# EAGLE design Headset board (EAGLE 9.5.0)
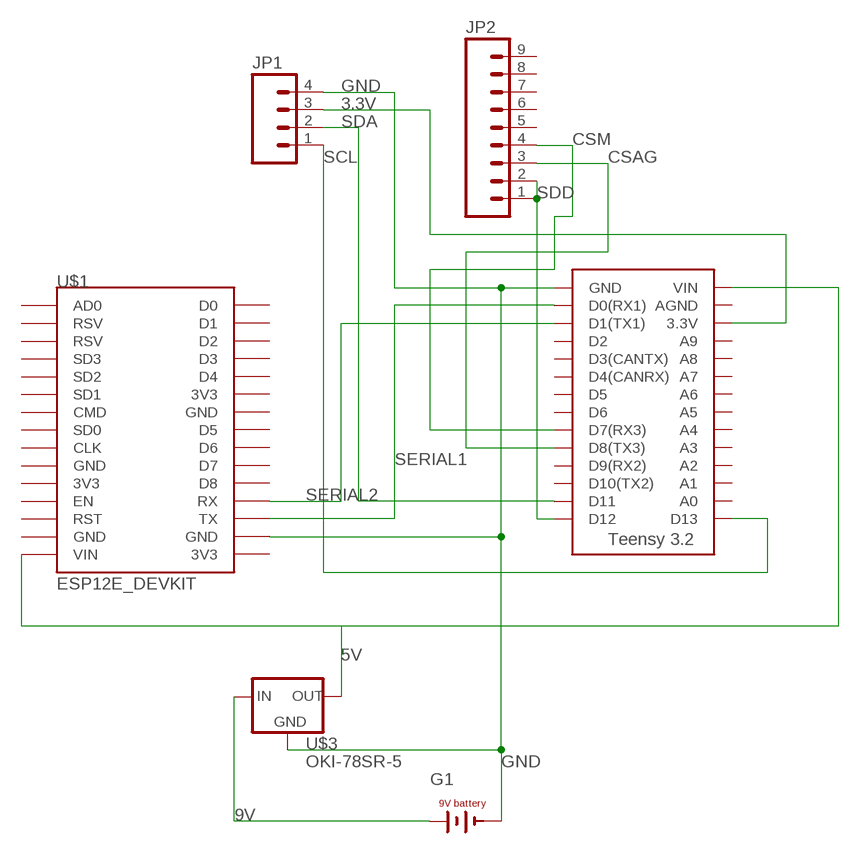
[diagram p0: schematic, sheet 1]

## Parts
G1  BAT9V  [AB9V]
JP1  M04  [1X04]
JP2  M09  [1X09]
U$1  ESP12E_DEVKIT  [ESP12E_DEVKIT]
U$2  TEENSY_3.2_SIMPLE  [TEENSY_3.2_SIMPLE]
U$3  OKI-78SR-5  [OKI-78SR]

## Nets
3.3V: JP1.3 U$2.3.3V
5V: U$1.VIN U$2.VIN U$3.3(OUT)
9V: G1.-(+) U$3.1(IN)
CSAG: JP2.3 U$2.D8(TX3)
CSM: JP2.4 U$2.D7(RX3)
GND: G1.+(-) JP1.4 U$1.GND@3(GND) U$2.GND U$3.2(GND)
SCL: JP1.1 U$2.D13
SDA: JP1.2 U$2.D11
SDD: JP2.1 JP2.2 U$2.D12
SERIAL1: U$1.TX U$2.D0(RX1)
SERIAL2: U$1.RX U$2.D1(TX1)
Unconnected: JP2.5 JP2.6 JP2.7 JP2.8 JP2.9 U$1.3V3@0(3V3) U$1.3V3@1(3V3) U$1.3V3@2(3V3) U$1.AD0 U$1.CLK U$1.CMD U$1.D0 U$1.D1 U$1.D2 U$1.D3 U$1.D4 U$1.D5 U$1.D6 U$1.D7 U$1.D8 U$1.EN U$1.GND@0(GND) U$1.GND@1(GND) U$1.GND@2(GND) U$1.RST U$1.RSV@0(RSV) U$1.RSV@1(RSV) U$1.SD0 U$1.SD1 U$1.SD2 U$1.SD3 U$2.A0 U$2.A1 U$2.A2 U$2.A3 U$2.A4 U$2.A5 U$2.A6 U$2.A7 U$2.A8 U$2.A9 U$2.AGND U$2.D2 U$2.D3(CANTX) U$2.D4(CANRX) U$2.D5 U$2.D6 U$2.D9(RX2) U$2.D10(TX2)

## Library data of the parts
G1 = tango:BAT9V: 9-V BATTERY CLIP
JP1 = HyTechDevices:M04: Standard 4-pin 0.1" header. NOTES ON THE VARIANTS LOCK and LOCK_LONGPADS... This footprint was designed to help hold the alignment of a through-hole component (i.e. 6-pin header) while soldering it into place. You may notice that each hole has been shifted either up or down by 0.005 of an inch from it's more standard position (which is a perfectly straight line). This slight alteration caused the pins (the squares in the middle) to touch the edges of the holes. Because they are alternating, it causes a "brace" to hold the component in place. 0.005 has proven to be the perfect amount of "off-center" position when using our standard breakaway headers. Although looks a little odd when you look at the bare footprint, once you have a header in there, the alteration is very hard to notice. Also,if you push a header all the way into place, it is covered up entirely on the bottom side. This idea of altering the position of holes to aid alignment will be further integrated into the Sparkfun Library for other footprints. It can help hold any component with 3 or more connection pins. Note: The Sparkfun version includes many other packages including surface mount that may be of future interest. Source: Sparkfun <https://github.com/sparkfun/SparkFun-Eagle-Libraries>
JP2 = HyTechDevices:M09: Standard 9-pin 0.1" header. Source: Sparkfun <https://github.com/sparkfun/SparkFun-Eagle-Libraries>
U$1 = ESP12E_DEVKIT:ESP12E_DEVKIT: ESP12E DEVKIT BOARD
U$2 = HyTechDevices:TEENSY_3.2_SIMPLE: Simple version of the Teensy 3.2 board that only uses the 2 main rows of pins, not the inner pins or the pins opposite the usb port.
U$3 = HyTechDevices:OKI-78SR-5: Murata OKI-78SR 5V 1.5A Non-Isolated Switching Regulator DC/DC - Datasheet <https://power.murata.com/data/power/oki-78sr.pdf>

## Board
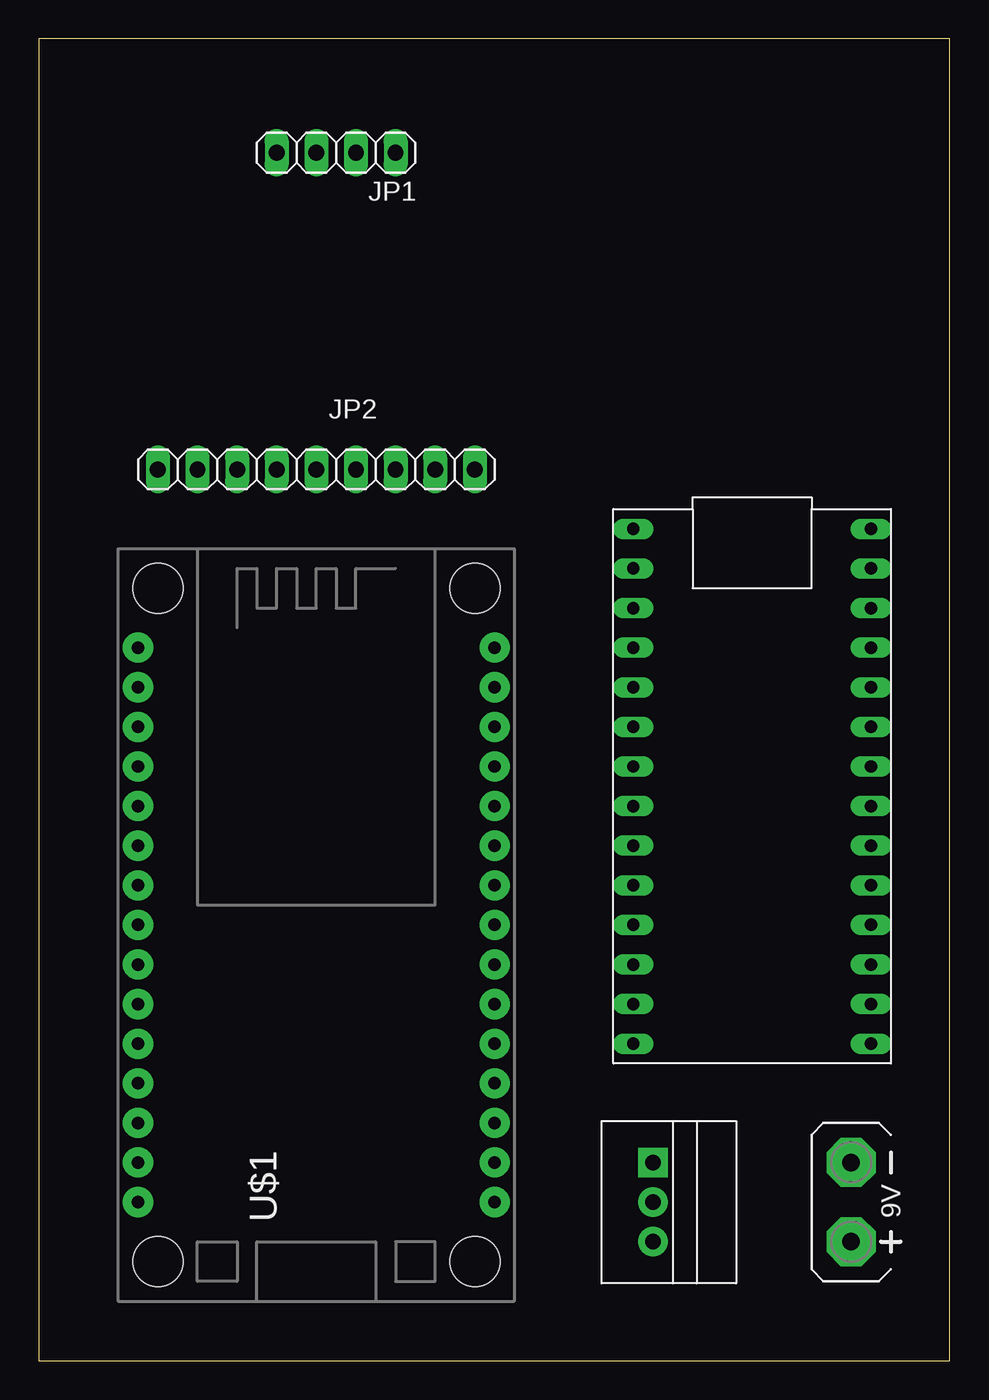
[diagram p1: board, top side]
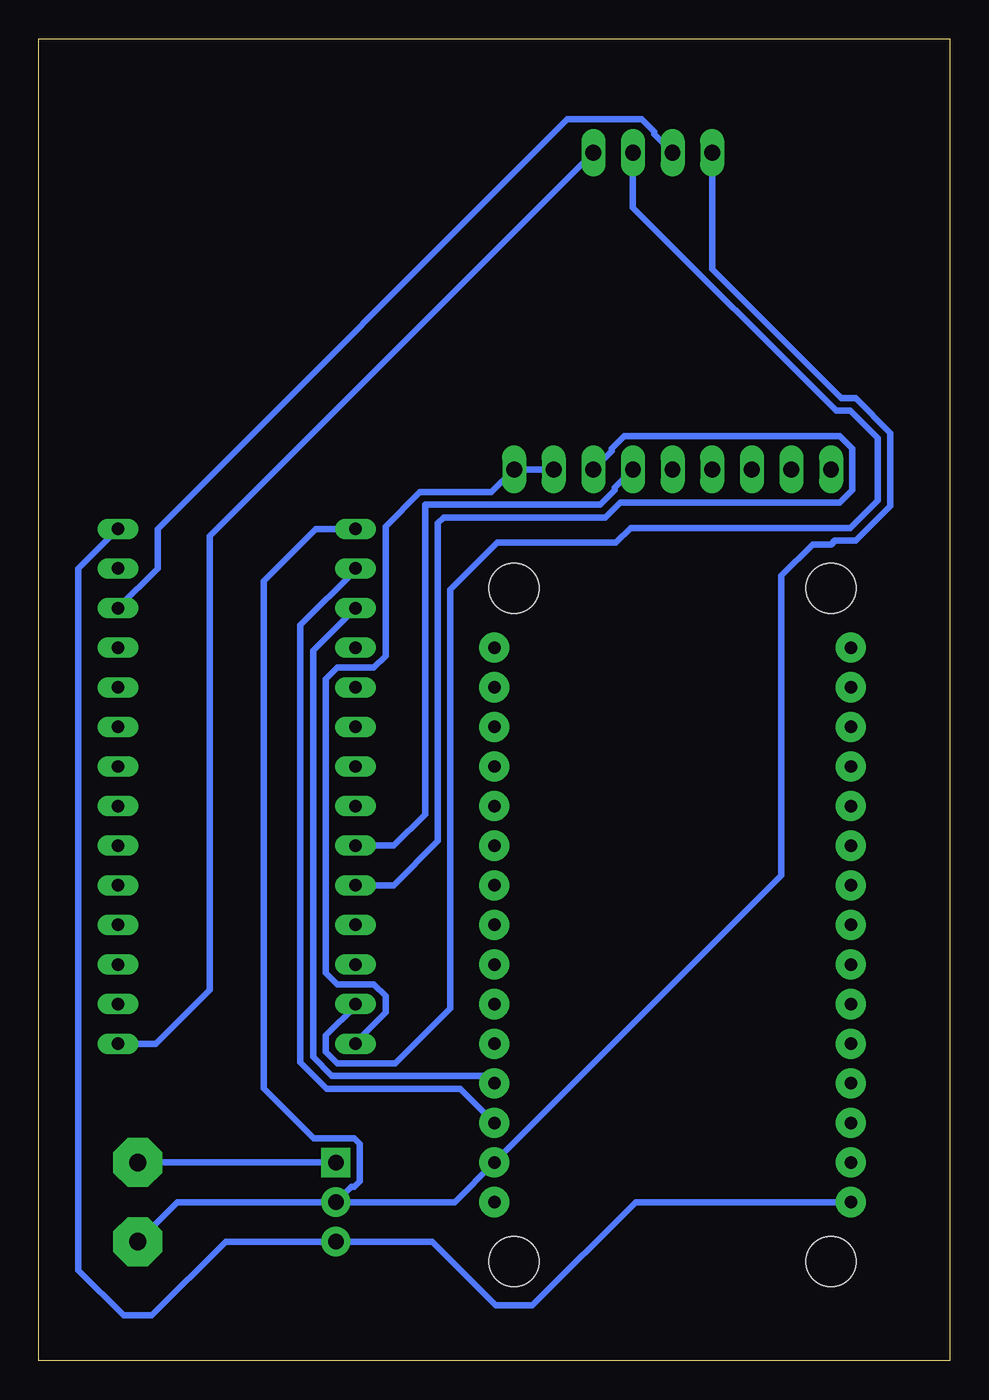
[diagram p2: board, bottom side, seen from below]

Size 58.4 x 84.76 mm. Coordinates in mm from the lower left corner, seen from the top.
Outline: 0,0 58.4,0 58.4,84.76 0,84.76 0,0
Copper layers (1*16): Top 0.035mm / dielectric 1.5mm / Bottom 0.035mm
Design rules "default *": minimum track width 6mil, minimum drill 0.35mm, track to track 16mil, track to pad 16mil, pad to pad 16mil, via to via 16mil, smd to smd 16mil, copper to edge 40mil, drill to drill 6mil, minimum pad ring 10mil, minimum via ring 8mil, stop-mask expansion 4mil, vias tented up to drill 0mil, thermal gap 10mil

### Footprints (pad centres in the part's own frame; a part is rotated, then mirrored left to right if it is on the bottom)
AB9V = drill 1.118 pad 3.15 octagon: + 0,2.54; - 0,-2.54
1X04 = drill 1.016 long: 1 -3.81,0; 2 -1.27,0; 3 1.27,0; 4 3.81,0
1X09 = drill 1.016 long: 1 -8.89,0; 2 -6.35,0; 3 -3.81,0; 4 -1.27,0; 5 1.27,0; 6 3.81,0; 7 6.35,0; 8 8.89,0; 9 11.43,0
ESP12E_DEVKIT = drill 0.8 pad 1.93: 3V3@0 -11.43,-7.62; 3V3@1 11.43,5.08; 3V3@2 11.43,-17.78; AD0 -11.43,17.78; CLK -11.43,-2.54; CMD -11.43,2.54; D0 11.43,17.78; D1 11.43,15.24; D2 11.43,12.7; D3 11.43,10.16; D4 11.43,7.62; D5 11.43,0; D6 11.43,-2.54; D7 11.43,-5.08; D8 11.43,-7.62; EN -11.43,-10.16; GND@0 -11.43,-5.08; GND@1 -11.43,-15.24; GND@2 11.43,2.54; GND@3 11.43,-15.24; RST -11.43,-12.7; RSV@0 -11.43,15.24; RSV@1 -11.43,12.7; RX 11.43,-10.16; SD0 -11.43,0; SD1 -11.43,5.08; SD2 -11.43,7.62; SD3 -11.43,10.16; TX 11.43,-12.7; VIN -11.43,-17.78 | hole 3.2: -10.16,21.59; 10.16,21.59; 10.16,-21.59; -10.16,-21.59
TEENSY_3.2_SIMPLE = drill 0.8 long: 3.3V 16.51,29.21; A0 16.51,3.81; A1 16.51,6.35; A2 16.51,8.89; A3 16.51,11.43; A4 16.51,13.97; A5 16.51,16.51; A6 16.51,19.05; A7 16.51,21.59; A8 16.51,24.13; A9 16.51,26.67; AGND 16.51,31.75; D0(RX1) 1.27,31.75; D1(TX1) 1.27,29.21; D2 1.27,26.67; D3(CANTX) 1.27,24.13; D4(CANRX) 1.27,21.59; D5 1.27,19.05; D6 1.27,16.51; D7(RX3) 1.27,13.97; D8(TX3) 1.27,11.43; D9(RX2) 1.27,8.89; D10(TX2) 1.27,6.35; D11 1.27,3.81; D12 1.27,1.27; D13 16.51,1.27; GND 1.27,34.29; VIN 16.51,34.29
OKI-78SR = drill 1 pad 1.88 square: 1 -2.54,0 | drill 1 pad 1.88: 2 0,0; 3 2.54,0

### Placement (x,y rotation side)
G1  52.07,10.16 180 top
JP1  19.05,77.47 180 top
JP2  19.05,57.15 180 top
U$1  17.78,27.94 0 top
U$2  36.83,19.05 0 top
U$3  39.37,10.16 270 top

### Tracks (layer width: path | path; a pad name or v marks a point on that pad's centre or on a via)
3.3V
  Bottom 0.406: U$2.3.3V 50.8,50.8 50.8,53.34 24.54,79.6 19.75,79.6 18.95,78.8 18.95,78.64 JP1.3
5V
  Bottom 0.406: U$1.VIN 20.14,10.16 26.77,3.53 29.11,3.53 33.2,7.62 U$3.3 46.44,7.62 51.16,2.9 52.98,2.9 55.88,5.8 55.88,50.8 U$2.VIN
9V
  Bottom 0.406: U$3.1 G1.-
CSAG
  Bottom 0.406: U$2.D8(TX3) 35.66,30.48 32.83,33.31 32.83,53.71 32.46,54.08 22.08,54.08 21.14,55.02 7.05,55.02 6.25,55.82 6.25,58.48 6.9,59.14 7.05,59.28 20.89,59.28 21.69,58.48 21.69,58.32 JP2.3
CSM
  Bottom 0.406: JP2.4 21.49,55.98 21.49,55.82 22.42,54.89 33.64,54.89 33.64,35.04 35.66,33.02 U$2.D7(RX3)
GND
  Bottom 0.406: U$3.2 49.53,10.16 G1.+ | U$3.2 31.75,10.16 U$1.GND@3 10.8,31.11 10.8,50.34 8.79,52.35 7.62,52.35 7.39,52.58 6.04,52.58 3.81,54.81 3.81,59.49 6.04,61.72 6.95,61.72 15.24,70.01 JP1.4 | U$3.2 38.38,11.15 38.18,11.15 37.82,11.51 37.82,13.89 38.18,14.25 40.8,14.25 43.99,17.44 43.99,49.99 40.64,53.34 U$2.GND
SCL
  Bottom 0.406: JP1.1 47.45,52.88 47.45,23.77 50.9,20.32 U$2.D13
SDA
  Bottom 0.406: JP1.2 20.32,73.94 7.29,60.91 6.38,60.91 4.62,59.15 4.62,55.15 6.38,53.39 20.47,53.39 21.41,52.45 29.01,52.45 32.02,49.44 32.02,22.6 35.56,19.06 39.28,19.06 40.02,19.8 40.02,20.84 38.1,22.76 U$2.D11
SDD
  Bottom 0.406: JP2.2 JP2.1 29.39,55.7 33.98,55.7 36.18,53.5 36.18,45.2 36.94,44.44 39.28,44.44 40.02,43.7 40.02,24.88 39.27,24.12 36.92,24.12 36.18,23.38 36.18,22.34 38.1,20.42 U$2.D12
SERIAL1
  Bottom 0.406: U$1.TX 31.4,17.43 39.95,17.43 41.64,19.12 41.64,47.16 38.1,50.7 U$2.D0(RX1)
SERIAL2
  Bottom 0.406: U$1.RX 29.67,18.24 39.61,18.24 40.83,19.46 40.83,45.53 U$2.D1(TX1)